# EAGLE design Daughterboard (EAGLE 6.6.0)
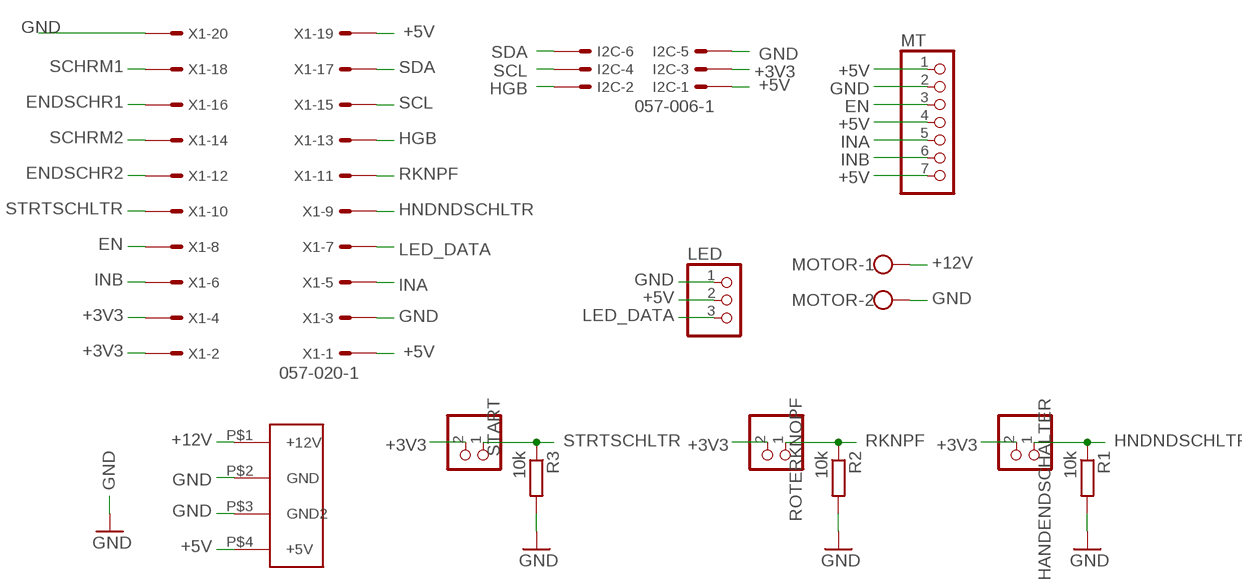
[diagram p0: schematic, sheet 1]

## Parts
HANDENDSCHALTER  PINHD-1X2  [1X02]
I2C  057-006-1  [057-006-1]
LED  PINHD-1X3  [1X03]
MOTOR  W237-102  [W237-102]
MT  PINHD-1X7  [1X07]
R1  10k  R-EU_0204/7  [0204/7]
R2  10k  R-EU_0204/7  [0204/7]
R3  10k  R-EU_0204/7  [0204/7]
ROTERKNOPF  PINHD-1X2  [1X02]
START  PINHD-1X2  [1X02]
U$1  MOLEX_STECKER  [MOLEXCONNECTOR]
X1  057-020-1  [057-020-1]

## Nets
+3V3: HANDENDSCHALTER.2 I2C.3 ROTERKNOPF.2 START.2 X1.2 X1.4
+5V: I2C.1 LED.2 MT.1 MT.4 MT.7 U$1.P$4(+5V) X1.1 X1.19
+12V: MOTOR.1 U$1.P$1(+12V)
EN: MT.3 X1.8
ENDSCHR1: X1.16
ENDSCHR2: X1.12
GND: I2C.5 LED.1 MOTOR.2 MT.2 R1.2 R2.2 R3.2 U$1.P$2(GND) U$1.P$3(GND2) X1.3 X1.20
HGB: I2C.2 X1.13
HNDNDSCHLTR: HANDENDSCHALTER.1 R1.1 X1.9
INA: MT.5 X1.5
INB: MT.6 X1.6
LED_DATA: LED.3 X1.7
RKNPF: R2.1 ROTERKNOPF.1 X1.11
SCHRM1: X1.18
SCHRM2: X1.14
SCL: I2C.4 X1.15
SDA: I2C.6 X1.17
STRTSCHLTR: R3.1 START.1 X1.10

## Library data of the parts
HANDENDSCHALTER ROTERKNOPF START = pinhead:PINHD-1X2: PIN HEADER
I2C = con-panduit:057-006-: CONNECTOR 6-pin series 057 contact pc board low profile headers; OC_FARNELL: unknown; OC_NEWARK: unknown
LED = pinhead:PINHD-1X3: PIN HEADER
MOTOR = con-wago-500:W237-102: WAGO SCREW CLAMP; MPN: 237-102; OC_FARNELL: unknown; OC_NEWARK: 70K9898
MT = pinhead:PINHD-1X7: PIN HEADER
R1-R3 = resistor:R-EU_: RESISTOR, European symbol
U$1 = Molex_Stecker:MOLEX_STECKER
X1 = con-panduit:057-020-: CONNECTOR 20-pin series 057 contact pc board low profile headers; OC_FARNELL: unknown; OC_NEWARK: unknown

## Board
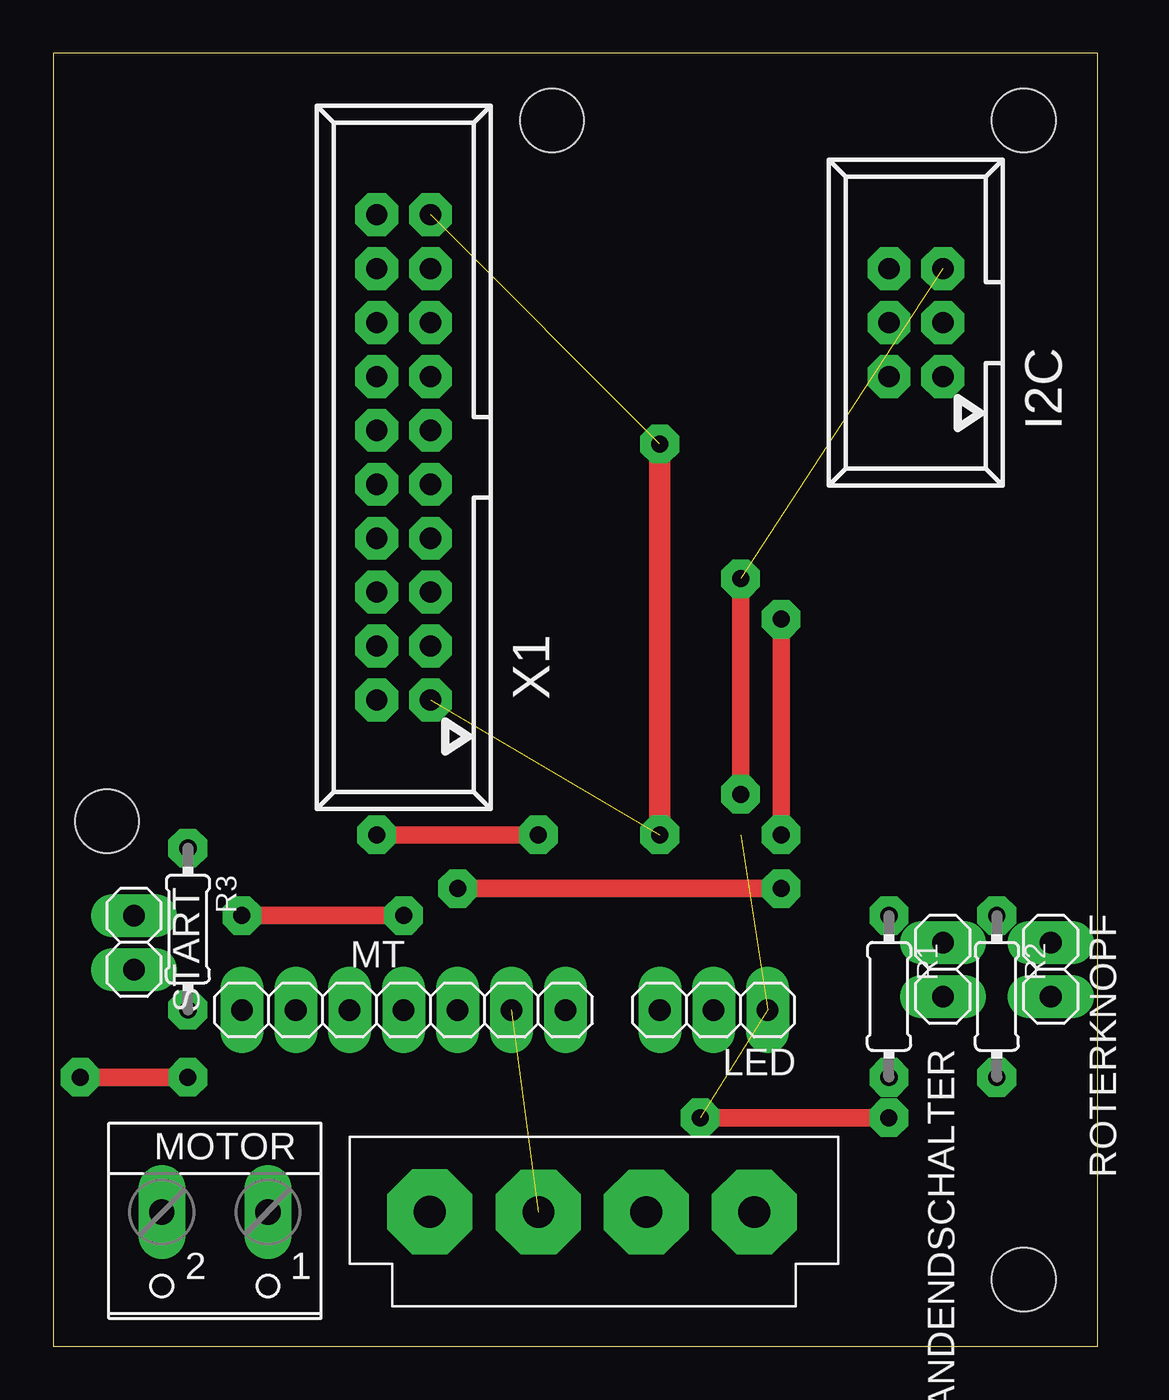
[diagram p1: board, top side]
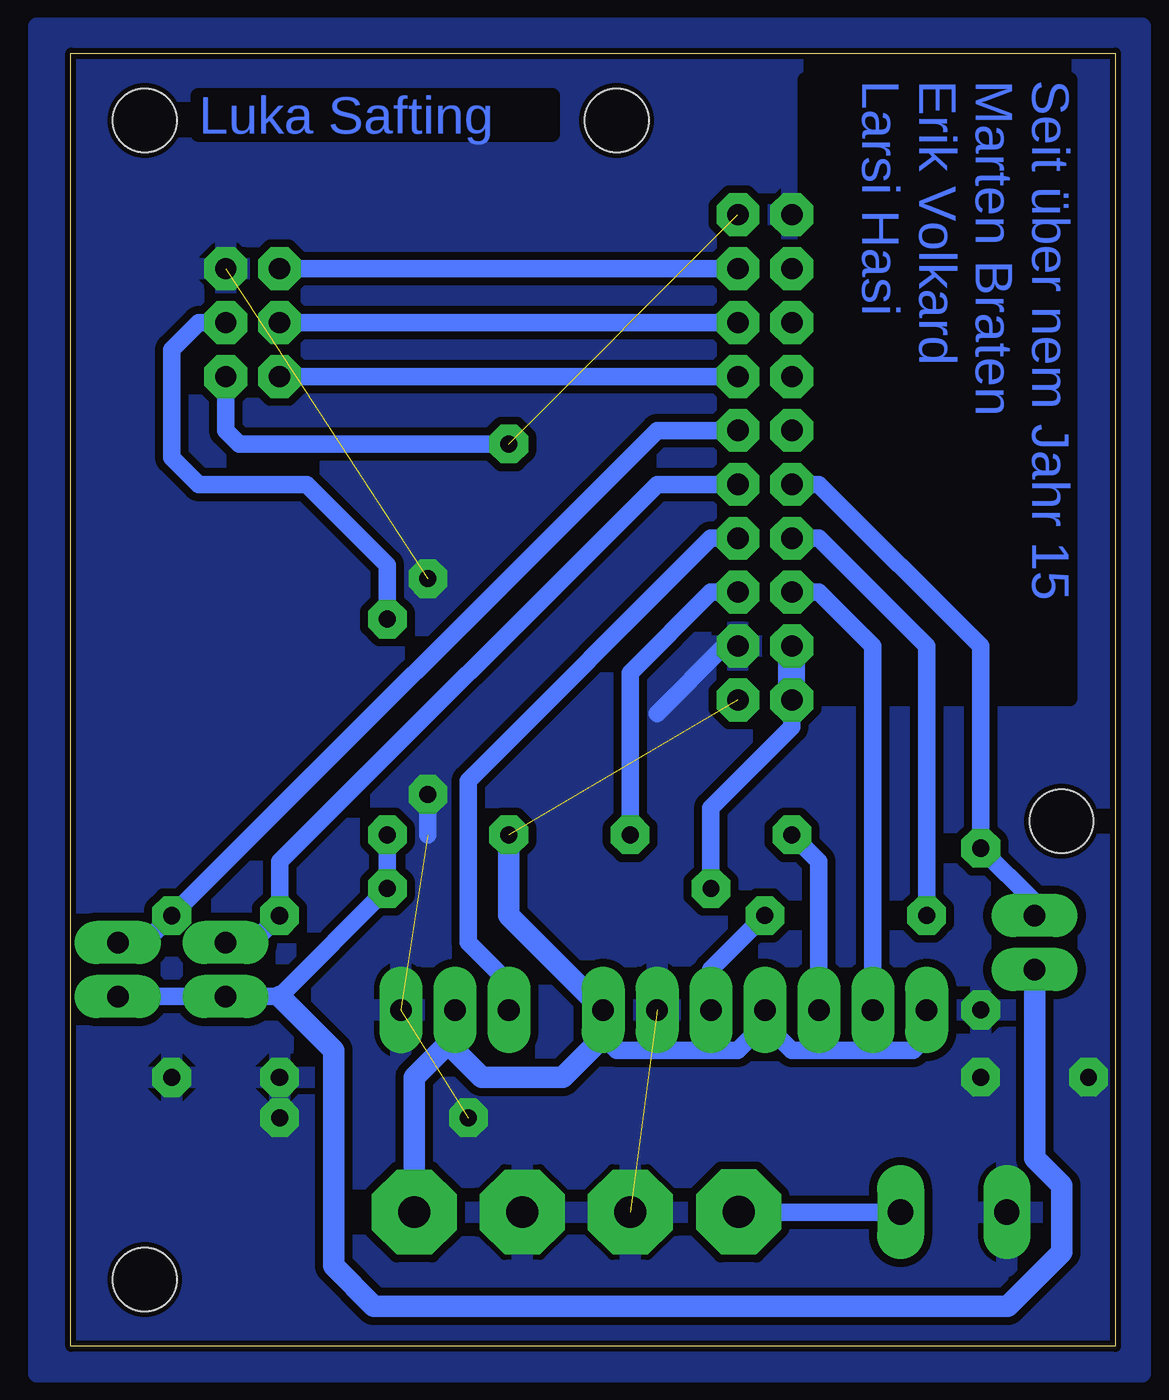
[diagram p2: board, bottom side, seen from below]

Size 49.2 x 60.94 mm. Coordinates in mm from the lower left corner, seen from the top.
Outline: 0,60.94 0,0 49.2,0 49.2,60.94 0,60.94
Copper layers (1*16): Top 0.035mm / dielectric 1.5mm / Bottom 0.035mm
Design rules "pl_design_rules": minimum track width 20mil, minimum drill 0.8mm, track to track 15mil, track to pad 20mil, pad to pad 20mil, via to via 20mil, smd to smd 8mil, copper to edge 10mil, drill to drill 8mil, minimum pad ring 20mil, minimum via ring 20mil, stop-mask expansion 4mil, vias tented up to drill 0mil, thermal gap 10mil
Holes 3 mm at 45.72,3.15 45.72,57.76 23.5,57.76 2.54,24.75

### Footprints (pad centres in the part's own frame; a part is rotated, then mirrored left to right if it is on the bottom)
1X02 = drill 1.016 long: 1 -1.27,0; 2 1.27,0
057-006-1 = drill 1 octagon: 1 -2.54,-1.27; 2 -2.54,1.27; 3 0,-1.27; 4 0,1.27; 5 2.54,-1.27; 6 2.54,1.27
1X03 = drill 1.016 long: 1 -2.54,0; 2 0,0; 3 2.54,0
W237-102 = drill 1.194 long: 1 -2.5,-1.27; 2 2.5,-1.27
1X07 = drill 1.016 long: 1 -7.62,0; 2 -5.08,0; 3 -2.54,0; 4 0,0; 5 2.54,0; 6 5.08,0; 7 7.62,0
0204/7 = drill 0.813 octagon: 1 -3.81,0; 2 3.81,0
MOLEXCONNECTOR = drill 1.5 pad 4 octagon: P$1 3.773,4.455; P$2 8.89,4.445; P$3 13.97,4.445; P$4 19.05,4.445
057-020-1 = drill 1 octagon: 1 -11.43,-1.27; 2 -11.43,1.27; 3 -8.89,-1.27; 4 -8.89,1.27; 5 -6.35,-1.27; 6 -6.35,1.27; 7 -3.81,-1.27; 8 -3.81,1.27; 9 -1.27,-1.27; 10 -1.27,1.27; 11 1.27,-1.27; 12 1.27,1.27; 13 3.81,-1.27; 14 3.81,1.27; 15 6.35,-1.27; 16 6.35,1.27; 17 8.89,-1.27; 18 8.89,1.27; 19 11.43,-1.27; 20 11.43,1.27

### Placement (x,y rotation side)
HANDENDSCHALTER  41.91,17.76 270 top
I2C  40.64,48.24 90 top
LED  31.11,15.86 180 top
MOTOR  7.62,5.06 180 top
MT  16.51,15.86 180 top
R1  39.37,16.49 270 top
R2  44.45,16.49 270 top
R3  6.35,19.66 270 top
ROTERKNOPF  46.99,17.76 270 top
START  3.81,19.03 270 top
U$1  13.97,1.89 0 top
X1  16.51,41.89 90 top

### Tracks (layer width: path | path; a pad name or v marks a point on that pad's centre or on a via)
+3V3  (via drill 0.8)
  Top 0.813: v19.05,21.57 v34.29,21.57 | v34.29,24.11 v34.29,34.27
  Bottom 0.813: ROTERKNOPF.2 HANDENDSCHALTER.2 39.37,16.49 v34.29,21.57 v34.29,24.11 | X1.2 15.24,29.19 19.05,25.38 v19.05,21.57 | I2C.3 43.18,48.24 44.45,46.97 44.45,41.89 43.18,40.62 38.1,40.62 34.29,36.81 v34.29,34.27
  Bottom 1.016: START.2 3.81,8.87 2.54,7.6 2.54,4.43 5.08,1.89 34.93,1.89 36.83,3.79 36.83,13.95 39.37,16.49
  Bottom 1.27: X1.2 X1.4
+5V  (via drill 0.8)  (2 unrouted)
  Top 1.016: v28.57,42.52 v28.57,24.11
  Bottom 0.813: 16.51,15.22 15.24,13.95 9.53,13.95 8.89,14.59 MT.7 | 16.51,15.22 17.78,13.95 23.5,13.95 24.13,14.59 MT.1 | 16.51,15.22 MT.4 | v28.57,42.52 41.28,42.52 41.91,43.16 I2C.1
  Bottom 1.016: 24.13,14.59 26.04,12.68 29.84,12.68 31.11,13.95 31.11,14.59 | v28.57,24.11 28.57,20.3 MT.1 | 31.11,14.59 LED.2 | U$1.P$4 33.02,12.68 31.11,14.59
+12V
  Bottom 0.813: MOTOR.1 U$1.P$1
EN  (via drill 0.8)
  Top 0.813: v16.51,20.3 v8.89,20.3
  Bottom 0.813: MT.3 19.05,17.76 v16.51,20.3 | v8.89,20.3 8.89,31.73 8.89,33 13.97,38.08 X1.8
GND  (via drill 0.8)  (4 unrouted)
  Top 0.813: v39.37,10.78 v30.48,10.78 | v32.38,26.02 v32.38,36.17 | v1.27,12.68 v6.35,12.68
  Bottom 0.813: 21.59,29.82 18.41,33 X1.3 | v32.38,26.02 32.38,24.11
  pour Bottom: -1.27,62.21 -1.27,-1.29 50.8,-1.29 50.8,62.21
HGB
  Bottom 0.813: X1.13 I2C.2
HNDNDSCHLTR
  Bottom 0.813: HANDENDSCHALTER.1 40.64,19.03 R1.1 39.37,22.84 21.59,40.62 X1.9
INA  (via drill 0.8)
  Top 0.813: v15.24,24.11 v22.86,24.11
  Bottom 0.813: MT.5 13.97,22.84 v15.24,24.11 | v22.86,24.11 22.86,30.46 22.86,31.73 19.05,35.54 X1.5
INB
  Bottom 0.813: MT.6 11.43,33 13.97,35.54 X1.6
LED_DATA
  Bottom 0.813: LED.3 28.57,17.12 30.48,19.03 30.48,25.38 30.48,26.65 19.05,38.08 X1.7
N$1
  pour Bottom: -1.27,62.21 -1.27,-1.29 50.8,-1.29 50.8,62.21
RKNPF
  Bottom 0.813: ROTERKNOPF.1 45.72,19.03 R2.1 21.59,43.16 X1.11
SCL
  Bottom 0.813: X1.15 I2C.4
SDA
  Bottom 0.813: X1.17 I2C.6
STRTSCHLTR
  Bottom 0.813: START.1 3.81,20.93 R3.1 6.35,33 13.97,40.62 X1.10

### Text on the board
Bottom: Seit über nem Jahr 15 / Marten Braten / Erik Volkard / Larsi Hasi | Luka Safting